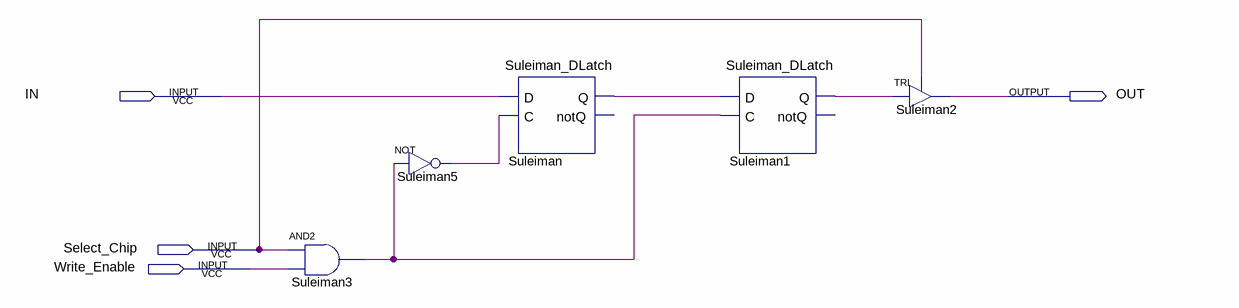
[diagram p0: schematic sheet]
// Quartus schematic Suleiman_MasterSlave.bdf as structural Verilog: 5 symbols, 4 pins
module Suleiman_MasterSlave (
  input  IN,
  input  Select_Chip,
  input  Write_Enable,
  output OUT
);

  wire Suleiman1_q, Suleiman3_out, Suleiman5_out, Suleiman_q;

  and Suleiman3 (Suleiman3_out, Select_Chip, Write_Enable);
  not Suleiman5 (Suleiman5_out, Suleiman3_out);
  Suleiman_DLatch Suleiman (.D(IN), .C(Suleiman5_out), .Q(Suleiman_q));  // open: notQ
  Suleiman_DLatch Suleiman1 (.D(Suleiman_q), .C(Suleiman3_out), .Q(Suleiman1_q));  // open: notQ
  TRI Suleiman2 (.IN(Suleiman1_q), .OE(Select_Chip), .OUT(OUT));
endmodule
